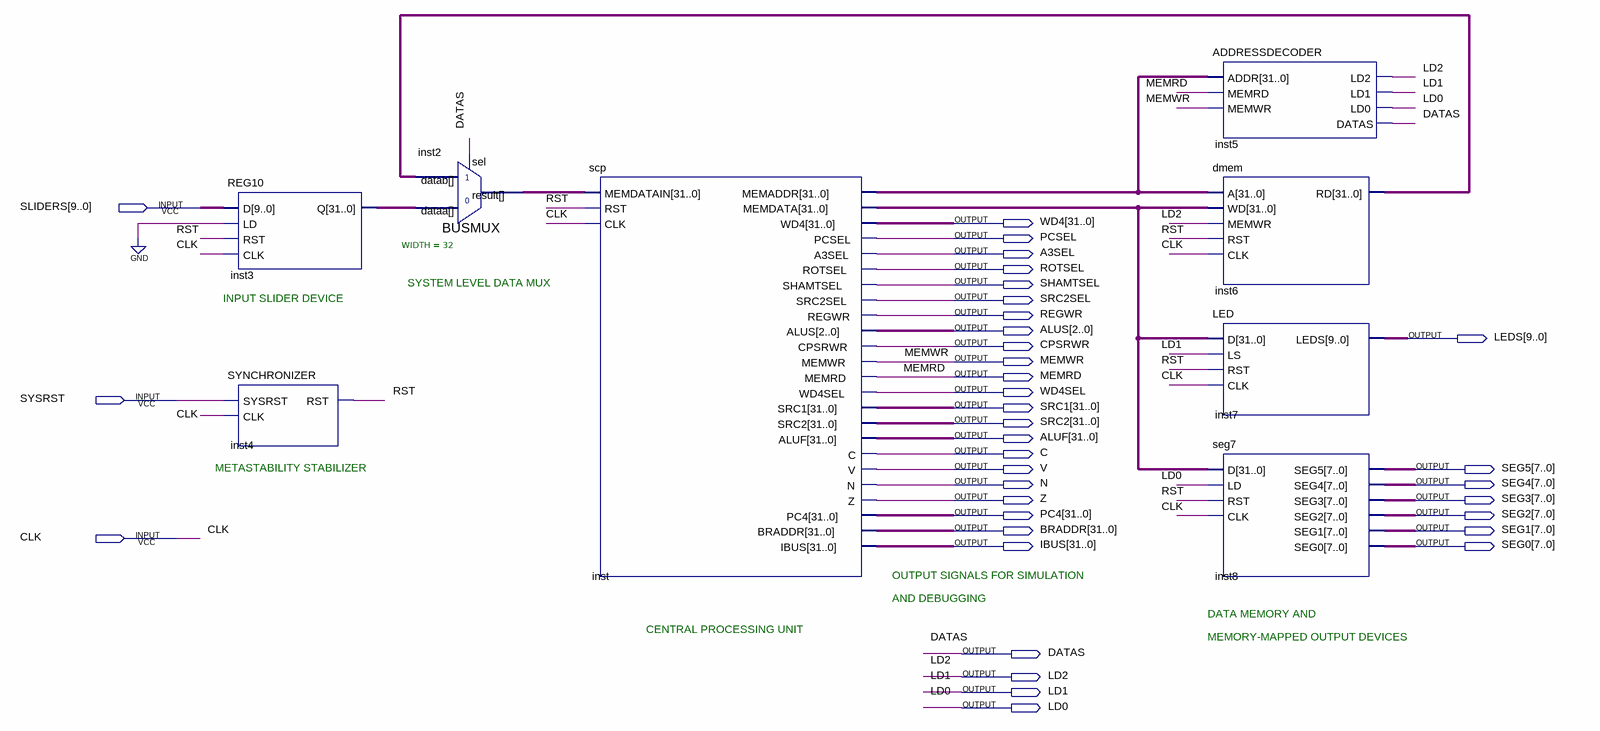
[diagram p0: schematic sheet]
// Quartus schematic system.bdf as structural Verilog: 8 symbols, 36 pins
module system (
  input  [9:0] SLIDERS,
  input  SYSRST,
  input  CLK,
  output [31:0] WD4,
  output PCSEL,
  output A3SEL,
  output ROTSEL,
  output SHAMTSEL,
  output SRC2SEL,
  output REGWR,
  output [2:0] ALUS,
  output [9:0] LEDS,
  output CPSRWR,
  output MEMWR,
  output MEMRD,
  output WD4SEL,
  output [31:0] SRC1,
  output [31:0] SRC2,
  output [31:0] ALUF,
  output C,
  output V,
  output [7:0] SEG5,
  output N,
  output [7:0] SEG4,
  output Z,
  output [7:0] SEG3,
  output [31:0] PC4,
  output [7:0] SEG2,
  output [31:0] BRADDR,
  output [7:0] SEG1,
  output [31:0] IBUS,
  output [7:0] SEG0,
  output DATAS,
  output LD2,
  output LD1,
  output LD0
);

  wire RST;
  wire [31:0] inst2_result, inst3_q, inst6_rd, inst_memaddr, inst_memdata;

  REG10 inst3 (.D(SLIDERS), .LD(1'b0), .RST(RST), .CLK(CLK), .Q(inst3_q));
  SYNCHRONIZER inst4 (.SYSRST(SYSRST), .CLK(CLK), .RST(RST));
  BUSMUX #(.WIDTH(32)) inst2 (.datab(inst6_rd), .sel(DATAS), .dataa(inst3_q), .result(inst2_result));
  scp inst (
    .MEMDATAIN(inst2_result), .RST(RST), .CLK(CLK), .MEMADDR(inst_memaddr), .MEMDATA(inst_memdata),
    .WD4(WD4), .PCSEL(PCSEL), .A3SEL(A3SEL), .ROTSEL(ROTSEL), .SHAMTSEL(SHAMTSEL), .SRC2SEL(SRC2SEL),
    .REGWR(REGWR), .ALUS(ALUS), .CPSRWR(CPSRWR), .MEMWR(MEMWR), .MEMRD(MEMRD), .WD4SEL(WD4SEL), .SRC1(SRC1),
    .SRC2(SRC2), .ALUF(ALUF), .C(C), .V(V), .N(N), .Z(Z), .PC4(PC4), .BRADDR(BRADDR), .IBUS(IBUS));
  ADDRESSDECODER inst5 (
    .ADDR(inst_memaddr), .MEMRD(MEMRD), .MEMWR(MEMWR), .LD2(LD2), .LD1(LD1), .LD0(LD0), .DATAS(DATAS));
  dmem inst6 (.A(inst_memaddr), .WD(inst_memdata), .MEMWR(LD2), .RST(RST), .CLK(CLK), .RD(inst6_rd));
  LED inst7 (.D(inst_memdata), .LS(LD1), .RST(RST), .CLK(CLK), .LEDS(LEDS));
  seg7 inst8 (
    .D(inst_memdata), .LD(LD0), .RST(RST), .CLK(CLK), .SEG5(SEG5), .SEG4(SEG4), .SEG3(SEG3), .SEG2(SEG2),
    .SEG1(SEG1), .SEG0(SEG0));

  // Notes on the sheet:
  //   SYSTEM LEVEL DATA MUX
  //   INPUT SLIDER DEVICE
  //   METASTABILITY STABILIZER
  //   OUTPUT SIGNALS FOR SIMULATION
  //   AND DEBUGGING
  //   DATA MEMORY AND
  //   CENTRAL PROCESSING UNIT
  //   MEMORY-MAPPED OUTPUT DEVICES
endmodule
